# EAGLE design 8MBSIMM (EAGLE 6.2)
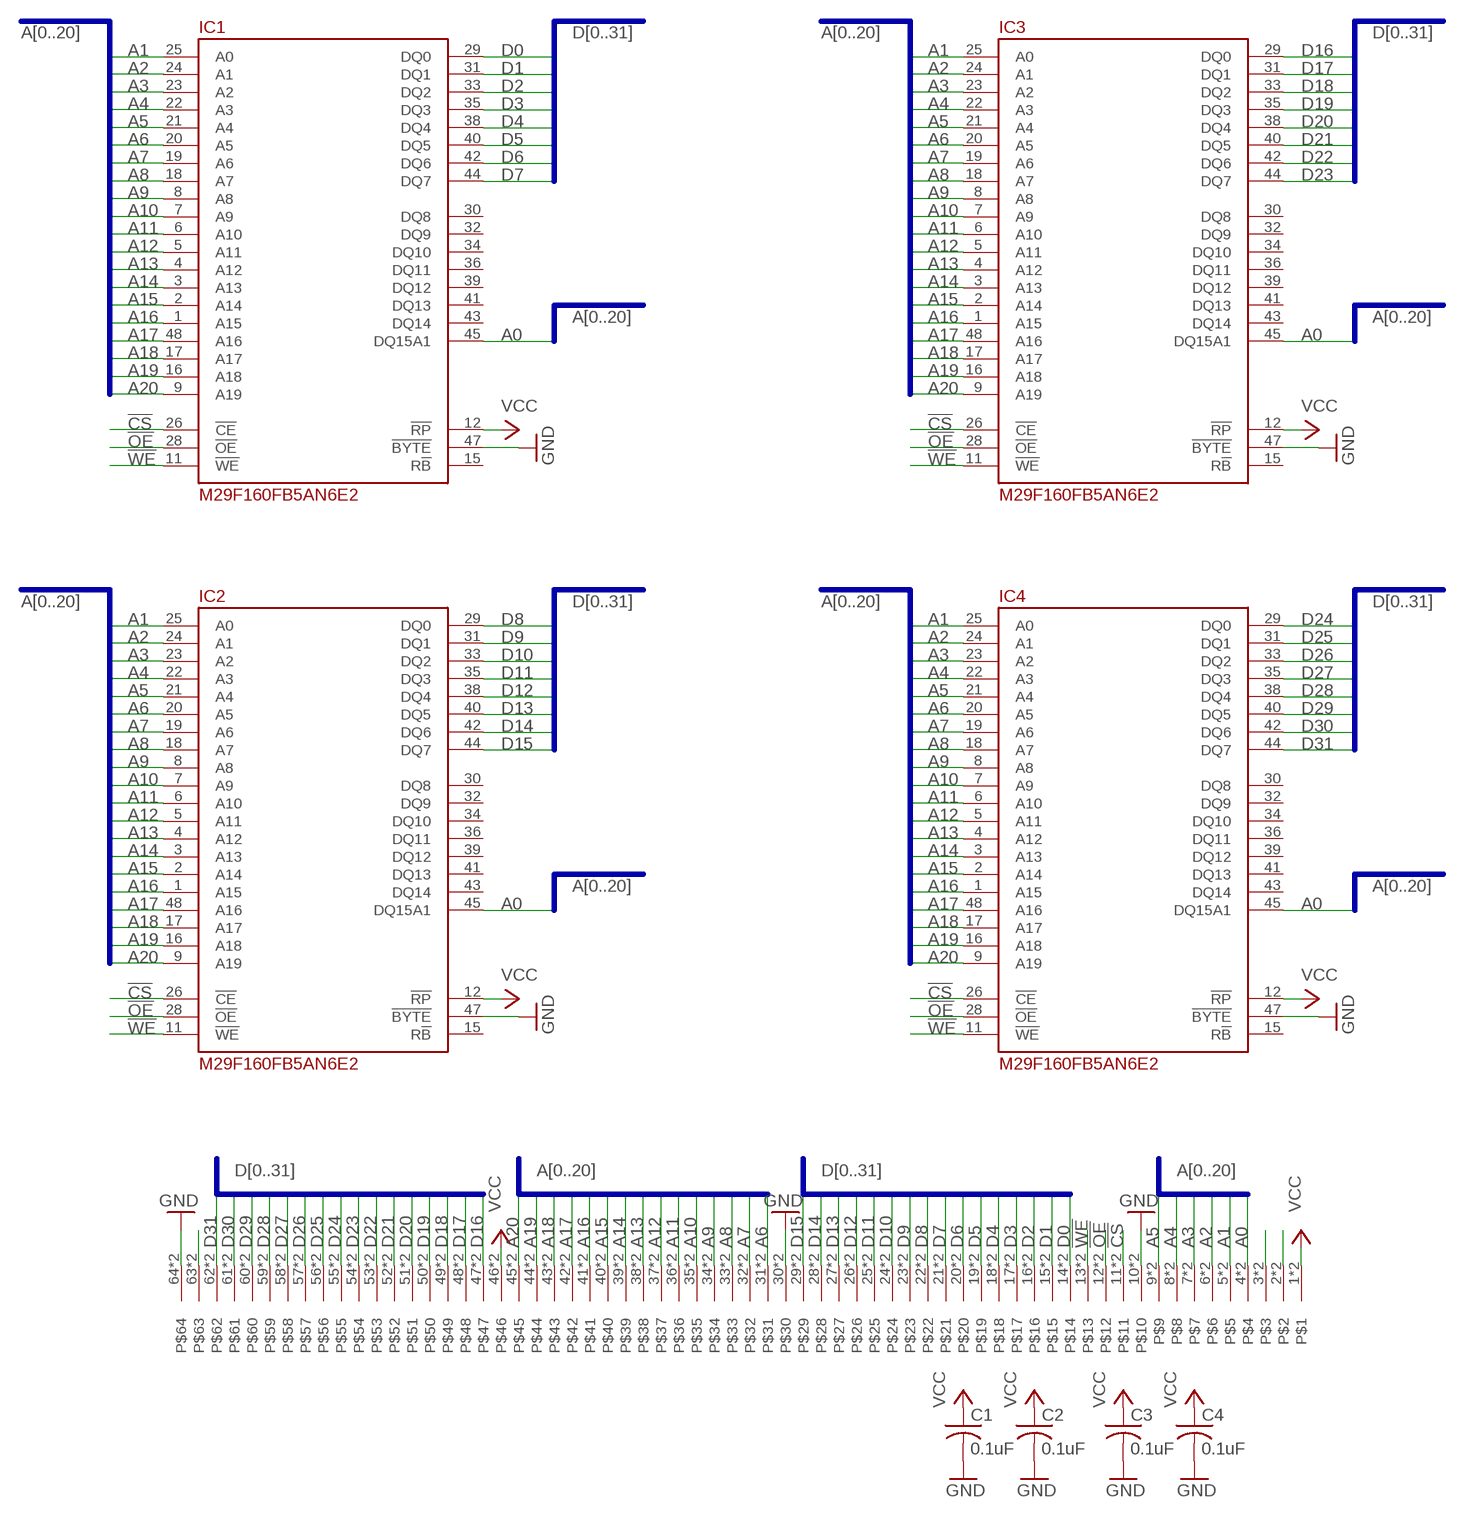
[diagram p0: schematic, sheet 1]

## Parts
C1  0.1uF  C-USC1206  [C1206]
C2  0.1uF  C-USC1206  [C1206]
C3  0.1uF  C-USC1206  [C1206]
C4  0.1uF  C-USC1206  [C1206]
CON1  MYSIMM  [SIMM64L]
IC1  M29F160FB5AN6E2  [TSOP48]
IC2  M29F160FB5AN6E2  [TSOP48]
IC3  M29F160FB5AN6E2  [TSOP48]
IC4  M29F160FB5AN6E2  [TSOP48]

## Nets
!CS: CON1.11 CON1.75 IC1.26(!CE) IC2.26(!CE) IC3.26(!CE) IC4.26(!CE)
!OE: CON1.12 CON1.76 IC1.28(!OE) IC2.28(!OE) IC3.28(!OE) IC4.28(!OE)
!WE: CON1.13 CON1.77 IC1.11(!WE) IC2.11(!WE) IC3.11(!WE) IC4.11(!WE)
A0: CON1.4 CON1.68 IC1.45(DQ15A1) IC2.45(DQ15A1) IC3.45(DQ15A1) IC4.45(DQ15A1)
A1: CON1.5 CON1.69 IC1.25(A0) IC2.25(A0) IC3.25(A0) IC4.25(A0)
A2: CON1.6 CON1.70 IC1.24(A1) IC2.24(A1) IC3.24(A1) IC4.24(A1)
A3: CON1.7 CON1.71 IC1.23(A2) IC2.23(A2) IC3.23(A2) IC4.23(A2)
A4: CON1.8 CON1.72 IC1.22(A3) IC2.22(A3) IC3.22(A3) IC4.22(A3)
A5: CON1.9 CON1.73 IC1.21(A4) IC2.21(A4) IC3.21(A4) IC4.21(A4)
A6: CON1.31 CON1.95 IC1.20(A5) IC2.20(A5) IC3.20(A5) IC4.20(A5)
A7: CON1.32 CON1.96 IC1.19(A6) IC2.19(A6) IC3.19(A6) IC4.19(A6)
A8: CON1.33 CON1.97 IC1.18(A7) IC2.18(A7) IC3.18(A7) IC4.18(A7)
A9: CON1.34 CON1.98 IC1.8(A8) IC2.8(A8) IC3.8(A8) IC4.8(A8)
A10: CON1.35 CON1.99 IC1.7(A9) IC2.7(A9) IC3.7(A9) IC4.7(A9)
A11: CON1.36 CON1.100 IC1.6(A10) IC2.6(A10) IC3.6(A10) IC4.6(A10)
A12: CON1.37 CON1.101 IC1.5(A11) IC2.5(A11) IC3.5(A11) IC4.5(A11)
A13: CON1.38 CON1.102 IC1.4(A12) IC2.4(A12) IC3.4(A12) IC4.4(A12)
A14: CON1.39 CON1.103 IC1.3(A13) IC2.3(A13) IC3.3(A13) IC4.3(A13)
A15: CON1.40 CON1.104 IC1.2(A14) IC2.2(A14) IC3.2(A14) IC4.2(A14)
A16: CON1.41 CON1.105 IC1.1(A15) IC2.1(A15) IC3.1(A15) IC4.1(A15)
A17: CON1.42 CON1.106 IC1.48(A16) IC2.48(A16) IC3.48(A16) IC4.48(A16)
A18: CON1.43 CON1.107 IC1.17(A17) IC2.17(A17) IC3.17(A17) IC4.17(A17)
A19: CON1.44 CON1.108 IC1.16(A18) IC2.16(A18) IC3.16(A18) IC4.16(A18)
A20: CON1.45 CON1.109 IC1.9(A19) IC2.9(A19) IC3.9(A19) IC4.9(A19)
D0: CON1.14 CON1.78 IC1.29(DQ0)
D1: CON1.15 CON1.79 IC1.31(DQ1)
D2: CON1.16 CON1.80 IC1.33(DQ2)
D3: CON1.17 CON1.81 IC1.35(DQ3)
D4: CON1.18 CON1.82 IC1.38(DQ4)
D5: CON1.19 CON1.83 IC1.40(DQ5)
D6: CON1.20 CON1.84 IC1.42(DQ6)
D7: CON1.21 CON1.85 IC1.44(DQ7)
D8: CON1.22 CON1.86 IC2.29(DQ0)
D9: CON1.23 CON1.87 IC2.31(DQ1)
D10: CON1.24 CON1.88 IC2.33(DQ2)
D11: CON1.25 CON1.89 IC2.35(DQ3)
D12: CON1.26 CON1.90 IC2.38(DQ4)
D13: CON1.27 CON1.91 IC2.40(DQ5)
D14: CON1.28 CON1.92 IC2.42(DQ6)
D15: CON1.29 CON1.93 IC2.44(DQ7)
D16: CON1.47 CON1.111 IC3.29(DQ0)
D17: CON1.48 CON1.112 IC3.31(DQ1)
D18: CON1.49 CON1.113 IC3.33(DQ2)
D19: CON1.50 CON1.114 IC3.35(DQ3)
D20: CON1.51 CON1.115 IC3.38(DQ4)
D21: CON1.52 CON1.116 IC3.40(DQ5)
D22: CON1.53 CON1.117 IC3.42(DQ6)
D23: CON1.54 CON1.118 IC3.44(DQ7)
D24: CON1.55 CON1.119 IC4.29(DQ0)
D25: CON1.56 CON1.120 IC4.31(DQ1)
D26: CON1.57 CON1.121 IC4.33(DQ2)
D27: CON1.58 CON1.122 IC4.35(DQ3)
D28: CON1.59 CON1.123 IC4.38(DQ4)
D29: CON1.60 CON1.124 IC4.40(DQ5)
D30: CON1.61 CON1.125 IC4.42(DQ6)
D31: CON1.62 CON1.126 IC4.44(DQ7)
GND [thicker]: C1.2 C2.2 C3.2 C4.2 CON1.10 CON1.30 CON1.64 CON1.74 CON1.94 CON1.128 IC1.47(!BYTE) IC2.47(!BYTE) IC3.47(!BYTE) IC4.47(!BYTE)
UNUSED1: CON1.2 CON1.66
UNUSED2: CON1.3 CON1.67
UNUSED3: CON1.63 CON1.127
VCC [thicker]: C1.1 C2.1 C3.1 C4.1 CON1.1 CON1.46 CON1.65 CON1.110 IC1.12(!RP) IC2.12(!RP) IC3.12(!RP) IC4.12(!RP)
Unconnected: IC1.15(R!B) IC1.30(DQ8) IC1.32(DQ9) IC1.34(DQ10) IC1.36(DQ11) IC1.39(DQ12) IC1.41(DQ13) IC1.43(DQ14) IC2.15(R!B) IC2.30(DQ8) IC2.32(DQ9) IC2.34(DQ10) IC2.36(DQ11) IC2.39(DQ12) IC2.41(DQ13) IC2.43(DQ14) IC3.15(R!B) IC3.30(DQ8) IC3.32(DQ9) IC3.34(DQ10) IC3.36(DQ11) IC3.39(DQ12) IC3.41(DQ13) IC3.43(DQ14) IC4.15(R!B) IC4.30(DQ8) IC4.32(DQ9) IC4.34(DQ10) IC4.36(DQ11) IC4.39(DQ12) IC4.41(DQ13) IC4.43(DQ14)

## Buses
A[0..20]
D[0..31]

## Power pins joined to a net without a drawn wire
GND: IC1.27(GND) IC1.46(GND) IC2.27(GND) IC2.46(GND) IC3.27(GND) IC3.46(GND) IC4.27(GND) IC4.46(GND)
VCC: IC1.37(VCC) IC2.37(VCC) IC3.37(VCC) IC4.37(VCC)

## Library data of the parts
C1-C4 = resistor:C-US: CAPACITOR, American symbol
CON1 = Doug:MYSIMM: 64-Pin SIMM
IC1-IC4 = Doug:M29F160FB5AN6E2

## Net classes
0 default: width 0.178 mm, drill 0.305 mm, clearance 0.178 mm
1 thicker: width 0.305 mm, drill 0.305 mm, clearance 0.178 mm

## Board
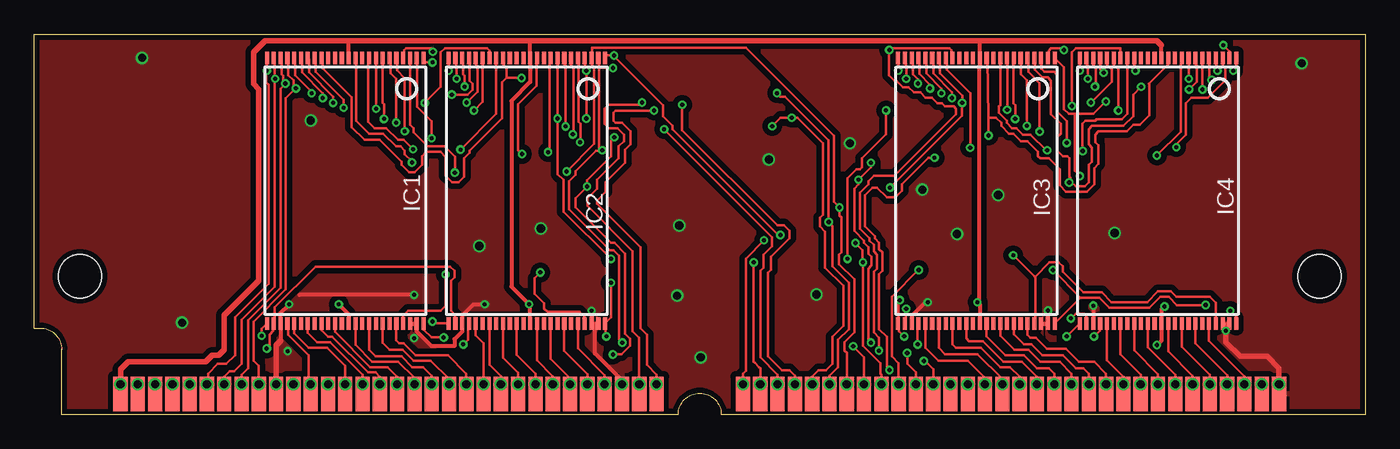
[diagram p1: board, top side]
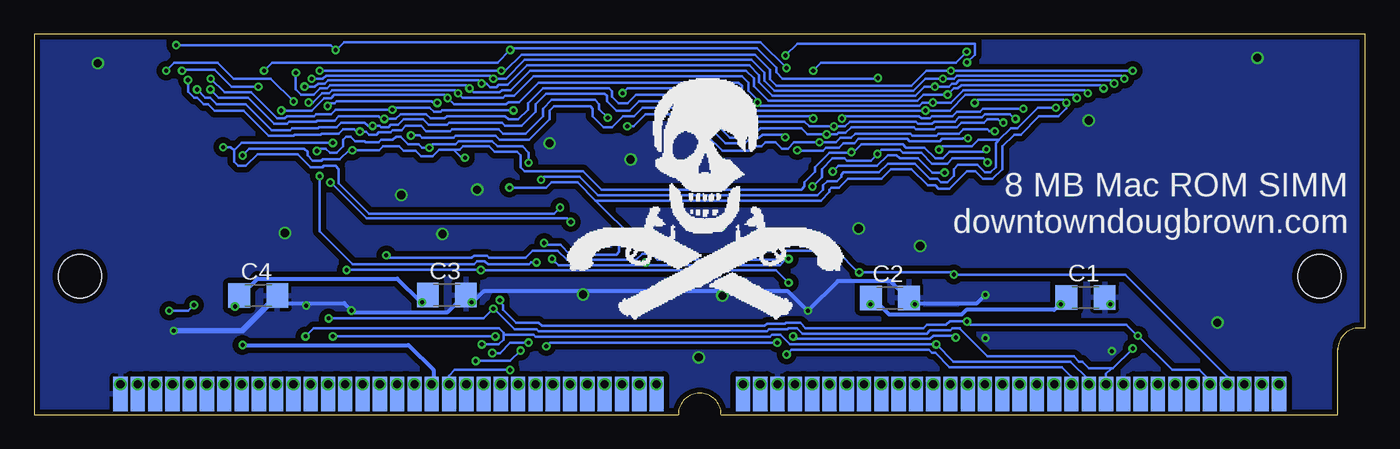
[diagram p2: board, bottom side, seen from below]

Size 97.79 x 27.94 mm. Coordinates in mm from the lower left corner, seen from the top.
Copper layers (1*2*15*16): Top 0.035mm / dielectric 0.2mm / layer 2 0.0175mm / dielectric 1.1mm / layer 15 0.0175mm / dielectric 0.2mm / Bottom 0.035mm
Design rules "SeeedStudio_DRU_no_angle_20130527": minimum track width 6mil, minimum drill 12mil, track to track 6mil, track to pad 6mil, pad to pad 6mil, via to via 6mil, smd to smd 0mil, copper to edge 10mil, drill to drill 10mil, minimum pad ring 6mil, minimum via ring 6mil, stop-mask expansion 2mil, vias tented up to drill 25mil, thermal gap 10mil

### Footprints (pad centres in the part's own frame; a part is rotated, then mirrored left to right if it is on the bottom)
C1206 = smd 1.6 x 1.8: 1 -1.4,0; 2 1.4,0
SIMM64L = smd 1.041 x 2.54: 1 -42.545,-8.636; 2 -41.275,-8.636; 3 -40.005,-8.636; 4 -38.735,-8.636; 5 -37.465,-8.636; 6 -36.195,-8.636; 7 -34.925,-8.636; 8 -33.655,-8.636; 9 -32.385,-8.636; 10 -31.115,-8.636; 11 -29.845,-8.636; 12 -28.575,-8.636; 13 -27.305,-8.636; 14 -26.035,-8.636; 15 -24.765,-8.636; 16 -23.495,-8.636; 17 -22.225,-8.636; 18 -20.955,-8.636; 19 -19.685,-8.636; 20 -18.415,-8.636; 21 -17.145,-8.636; 22 -15.875,-8.636; 23 -14.605,-8.636; 24 -13.335,-8.636; 25 -12.065,-8.636; 26 -10.795,-8.636; 27 -9.525,-8.636; 28 -8.255,-8.636; 29 -6.985,-8.636; 30 -5.715,-8.636; 31 -4.445,-8.636; 32 -3.175,-8.636; 33 3.175,-8.636; 34 4.445,-8.636; 35 5.715,-8.636; 36 6.985,-8.636; 37 8.255,-8.636; 38 9.525,-8.636; 39 10.795,-8.636; 40 12.065,-8.636; 41 13.335,-8.636; 42 14.605,-8.636; 43 15.875,-8.636; 44 17.145,-8.636; 45 18.415,-8.636; 46 19.685,-8.636; 47 20.955,-8.636; 48 22.225,-8.636; 49 23.495,-8.636; 50 24.765,-8.636; 51 26.035,-8.636; 52 27.305,-8.636; 53 28.575,-8.636; 54 29.845,-8.636; 55 31.115,-8.636; 56 32.385,-8.636; 57 33.655,-8.636; 58 34.925,-8.636; 59 36.195,-8.636; 60 37.465,-8.636; 61 38.735,-8.636; 62 40.005,-8.636; 63 41.275,-8.636; 64 42.545,-8.636 | smd 1.041 x 2.54 bottom: 65 -42.545,-8.636; 66 -41.275,-8.636; 67 -40.005,-8.636; 68 -38.735,-8.636; 69 -37.465,-8.636; 70 -36.195,-8.636; 71 -34.925,-8.636; 72 -33.655,-8.636; 73 -32.385,-8.636; 74 -31.115,-8.636; 75 -29.845,-8.636; 76 -28.575,-8.636; 77 -27.305,-8.636; 78 -26.035,-8.636; 79 -24.765,-8.636; 80 -23.495,-8.636; 81 -22.225,-8.636; 82 -20.955,-8.636; 83 -19.685,-8.636; 84 -18.415,-8.636; 85 -17.145,-8.636; 86 -15.875,-8.636; 87 -14.605,-8.636; 88 -13.335,-8.636; 89 -12.065,-8.636; 90 -10.795,-8.636; 91 -9.525,-8.636; 92 -8.255,-8.636; 93 -6.985,-8.636; 94 -5.715,-8.636; 95 -4.445,-8.636; 96 -3.175,-8.636; 97 3.175,-8.636; 98 4.445,-8.636; 99 5.715,-8.636; 100 6.985,-8.636; 101 8.255,-8.636; 102 9.525,-8.636; 103 10.795,-8.636; 104 12.065,-8.636; 105 13.335,-8.636; 106 14.605,-8.636; 107 15.875,-8.636; 108 17.145,-8.636; 109 18.415,-8.636; 110 19.685,-8.636; 111 20.955,-8.636; 112 22.225,-8.636; 113 23.495,-8.636; 114 24.765,-8.636; 115 26.035,-8.636; 116 27.305,-8.636; 117 28.575,-8.636; 118 29.845,-8.636; 119 31.115,-8.636; 120 32.385,-8.636; 121 33.655,-8.636; 122 34.925,-8.636; 123 36.195,-8.636; 124 37.465,-8.636; 125 38.735,-8.636; 126 40.005,-8.636; 127 41.275,-8.636; 128 42.545,-8.636 | hole 3.175: 45.517,0; -45.517,0
TSOP48 = smd 0.9 x 0.3: 1 -9.75,5.75; 2 -9.75,5.25; 3 -9.75,4.75; 4 -9.75,4.25; 5 -9.75,3.75; 6 -9.75,3.25; 7 -9.75,2.75; 8 -9.75,2.25; 9 -9.75,1.75; 10 -9.75,1.25; 11 -9.75,0.75; 12 -9.75,0.25; 13 -9.75,-0.25; 14 -9.75,-0.75; 15 -9.75,-1.25; 16 -9.75,-1.75; 17 -9.75,-2.25; 18 -9.75,-2.75; 19 -9.75,-3.25; 20 -9.75,-3.75; 21 -9.75,-4.25; 22 -9.75,-4.75; 23 -9.75,-5.25; 24 -9.75,-5.75; 25 9.75,-5.75; 26 9.75,-5.25; 27 9.75,-4.75; 28 9.75,-4.25; 29 9.75,-3.75; 30 9.75,-3.25; 31 9.75,-2.75; 32 9.75,-2.25; 33 9.75,-1.75; 34 9.75,-1.25; 35 9.75,-0.75; 36 9.75,-0.25; 37 9.75,0.25; 38 9.75,0.75; 39 9.75,1.25; 40 9.75,1.75; 41 9.75,2.25; 42 9.75,2.75; 43 9.75,3.25; 44 9.75,3.75; 45 9.75,4.25; 46 9.75,4.75; 47 9.75,5.25; 48 9.75,5.75

### Placement (x,y rotation side)
C1  20.56,8.61 0 bottom
C2  34.93,8.57 0 bottom
C3  67.47,8.77 0 bottom
C4  81.32,8.73 0 bottom
CON1  48.9,10.16 0 top
IC1  22.86,16.43 270 top
IC2  36.2,16.43 270 top
IC3  69.22,16.43 270 top
IC4  82.55,16.43 270 top
U$1  [JOLLYROGER]  58.58,7.06 0 bottom

### Tracks (layer width: path | path; a pad name or v marks a point on that pad's centre or on a via)
!CS  (via drill 0.3, 0.6)
  Top 0.178: v64.06,7.77 64.03,7.75 64.03,6.76 63.98,6.71 IC3.26 | v76.15,7.06 76.5,7.42 77.12,7.42 77.3,7.23 IC4.26 | IC2.26 30.94,6.71 30.94,7.32 30.64,7.62 30.64,9.84 30.88,10.08 30.88,10.56 30.56,10.87 20.68,10.87 17.68,7.87 17.68,6.76 17.63,6.71 IC1.26 17.58,6.6 17.58,6.15 17.3,5.87 17.3,5.05 v17.09,4.85
  Top 0.406: CON1.75 v19.05,2.22
  Bottom 0.178: v76.15,7.06 64.77,7.06 v64.06,7.77 63.98,7.75 62.51,6.27 60.88,6.27 60.72,6.11 43.97,6.11 43.82,6.27 42.47,6.27 42.39,6.35 41.75,6.35 41.35,5.95 32.23,5.95 31.99,6.19 30.48,6.19 30.35,6.33 29.8,6.33 29.8,6.31 27.78,4.29 21.43,4.29 21.03,3.89 20.8,3.89 20.31,3.4 18.64,3.4 | 18.64,3.4 19.05,3 v19.05,2.22 | 18.64,3.4 18.54,3.4 v17.09,4.85
  Bottom 0.305: CON1.75 v19.05,2.22
!OE  (via drill 0.3, 0.6)
  Top 0.178: v64.9,5.16 64.9,6.63 64.95,6.68 IC3.28 | v77.85,5.74 78.28,6.17 78.28,6.68 IC4.28 | IC1.28 18.67,6.63 18.67,5.86 20.16,4.37 20.16,2.38 v20.32,2.22 | v31.52,5.16 31.88,5.51 31.88,6.63 31.93,6.68 IC2.28
  Top 0.406: CON1.76 v20.32,2.22
  Bottom 0.178: v64.9,5.16 63.68,5.16 63.32,5.51 63.32,5.87 | v77.85,5.74 77.27,6.33 63.63,6.33 63.32,6.01 63.32,5.87 | 63.32,5.87 61.11,5.87 60.96,5.71 43.74,5.71 43.58,5.87 42.98,5.87 42.27,5.16 v31.52,5.16 30.26,3.89 21.67,3.89 20.32,2.54 v20.32,2.22
  Bottom 0.305: CON1.76 v20.32,2.22
!WE  (via drill 0.3, 0.6)
  Top 0.178: v70.11,20.49 70.09,21.81 | 70.09,21.81 70.03,26.11 69.98,26.16 IC3.11 | IC4.11 83.29,26.16 83.29,25.68 81.89,24.28 81.91,24.26 81.91,21.99 81.2,21.27 80.72,21.27 80.25,20.8 78.18,20.8 77.95,20.56 77.95,20 78.18,19.76 78.18,18.41 77.87,18.1 77.87,16.91 77.31,16.35 75.8,16.35 75.33,16.83 75.33,18.02 74.53,18.81 73.9,18.81 73.74,18.97 73.74,19.29 72.95,20.08 72.47,20.08 71.91,20.64 71.6,20.64 71.04,21.19 71.04,21.43 70.66,21.81 70.09,21.81 | IC1.11 23.62,26.16 23.67,26.11 23.67,21.57 24.6,20.64 25.64,20.64 26.59,19.68 26.91,19.68 27.23,19.37 27.23,19.13 27.76,18.6 v27.76,18.51 | 36.93,26.16 IC2.11 36.91,26.14 36.91,24.13 35.56,22.78 35.56,19.43 v35.85,19.14 | v42.62,20.36 42.39,20.13 42.39,18.97 40.62,17.2 v40.62,16.74 39.77,15.89 39.77,15.24 42.39,12.62 42.62,12.62 43.42,11.83 43.42,5.95 43.79,5.58 43.79,5.05 43.15,4.42 v42.52,4.42
  Top 0.406: CON1.77 v21.59,2.22
  Bottom 0.178: v27.76,18.51 28.06,18.81 30.32,18.81 30.72,18.41 31.83,18.41 32.62,19.21 33.97,19.21 34.21,19.45 35.54,19.45 v35.85,19.14 36.33,18.65 38.1,18.65 38.26,18.81 39.13,18.81 39.93,18.02 39.93,17.43 v40.62,16.74 | v42.62,20.36 42.82,20.56 44.29,20.56 44.53,20.32 45.16,20.32 45.56,19.92 46.99,19.92 47.94,20.88 47.94,22.15 48.34,22.54 53.1,22.54 53.74,21.91 54.53,21.91 55.32,21.11 55.96,21.11 56.75,21.91 56.75,22.46 56.91,22.62 59.61,22.62 59.93,22.3 59.93,21.67 61.44,20.16 63.58,20.16 63.9,20.48 66.83,20.48 66.99,20.32 69.29,20.32 69.47,20.49 v70.11,20.49 | v42.52,4.42 42.17,4.76 32.07,4.76 31.83,4.52 31.59,4.52 30.56,3.49 22.29,3.49 21.59,2.79 v21.59,2.22
  Bottom 0.305: CON1.77 v21.59,2.22
A0  (via drill 0.3, 0.6)
  Top 0.178: 73.53,10.13 73.53,6.76 73.48,6.71 IC3.45 | IC4.45 86.79,6.71 86.79,8.22 86.36,8.65 83.9,8.65 83.5,9.05 82.55,9.05 81.76,8.26 79.14,8.26 78.42,8.97 77.07,8.97 75.56,10.48 75.56,10.87 75.25,11.19 74.59,11.19 73.53,10.13 | IC2.45 40.44,6.71 40.44,7.19 40.08,7.54 37.7,7.54 37.47,7.78 37.47,8.18 36.75,8.89 36.75,10 v37.19,10.44 | v71.92,11.7 73.46,10.16 73.53,10.13 | IC1.45 27.11,7.27 27.46,7.62 29.85,7.62 30.23,8 v30.23,10.29
  Top 0.406: CON1.68 v10.16,2.22
  Bottom 0.178: v10.16,2.22 10.16,2.79 17.63,10.26 30.15,10.26 v30.23,10.29 30.38,10.44 v37.19,10.44 37.26,10.46 38.81,12.01 42.68,12.01 43.34,11.35 51.99,11.35 52.47,11.83 53.1,11.83 53.58,11.35 58.66,11.35 59.32,12.01 61.17,12.01 61.67,11.51 64.37,11.51 64.53,11.67 65.48,11.67 65.64,11.51 71.73,11.51 v71.92,11.7
  Bottom 0.305: CON1.68 v10.16,2.22
A1  (via drill 0.3, 0.6)
  Top 0.178: v63.91,5.74 63.52,6.12 63.52,6.63 IC3.25 63.48,6.76 63.48,8.31 v63.58,8.41 | v75.84,5.74 76.78,6.68 IC4.25 | v16.71,5.79 16.71,6.3 17.09,6.68 IC1.25 | v29.26,6.83 29.26,6.71 30.43,6.71 IC2.25
  Top 0.406: CON1.69 v11.43,2.22
  Bottom 0.178: v75.84,5.74 v63.91,5.74 | 11.51,2.59 12.19,3.28 14.2,3.28 v16.71,5.79 16.79,5.82 17.58,6.6 29.03,6.6 v29.26,6.83 29.34,6.86 30.53,6.86 30.8,6.59 32.23,6.59 32.46,6.35 41.12,6.35 41.51,6.75 42.55,6.75 42.62,6.67 43.97,6.67 44.13,6.51 60.48,6.51 60.72,6.75 62.39,6.75 63.34,7.7 63.34,8.02 63.58,8.25 v63.58,8.41
  Bottom 0.305: CON1.69 v11.43,2.22 11.43,2.59 11.51,2.59
A2  (via drill 0.3, 0.6)
  Top 0.178: v63.48,25.25 63.48,26.16 IC3.24 | v76.81,25.25 76.81,26.16 IC4.24 | CON1.70 12.78,2.41 12.78,3.01 13.49,3.73 14.13,3.73 14.76,4.37 14.76,7.14 17.22,9.6 17.22,24.21 17.07,24.37 17.07,25.22 v17.09,25.25 17.09,26.16 IC1.24 | v30.46,25.25 30.46,26.16 IC2.24
  Top 0.406: CON1.70 v12.7,2.22
  Bottom 0.178: v76.81,25.25 v63.48,25.25 63.18,25.25 61.99,26.43 44.85,26.43 43.74,25.32 43.74,24.61 43.26,24.13 33.35,24.13 32.23,25.25 v30.46,25.25 v17.09,25.25
  Bottom 0.305: CON1.70 v12.7,2.22
A3  (via drill 0.3, 0.6)
  Top 0.178: v64.06,24.66 64.06,25.48 64.03,25.5 64.03,26.11 63.98,26.16 IC3.23 | v77.39,24.66 77.39,25.6 77.32,25.68 77.32,26.16 IC4.23 | 17.68,24.66 17.68,9.4 15.24,6.96 15.24,3.73 14.68,3.17 14.37,3.17 13.97,2.78 v13.97,2.22 | 17.68,24.66 17.68,26.11 17.63,26.16 IC1.23 | v31.04,24.66 31.04,25.48 31.01,25.5 31.01,26.11 30.96,26.16 IC2.23 | v17.7,24.66 17.68,24.66
  Top 0.406: CON1.71 v13.97,2.22
  Bottom 0.178: v77.39,24.66 76.58,24.66 76.35,24.89 64.29,24.89 v64.06,24.66 63.12,24.66 61.75,26.04 45.09,26.04 44.13,25.08 44.13,24.5 43.41,23.77 33.2,23.77 32.31,24.66 v31.04,24.66 30.23,24.66 30,24.89 17.93,24.89 v17.7,24.66
  Bottom 0.305: CON1.71 v13.97,2.22
A4  (via drill 0.3, 0.6)
  Top 0.178: v64.92,24.31 64.92,24.61 64.54,24.99 64.54,26.09 64.47,26.16 IC3.22 | v77.93,24.08 77.98,24.13 77.98,25.5 77.8,25.68 77.8,26.16 IC4.22 | IC1.22 18.11,26.16 18.19,26.09 18.19,24.99 18.29,24.89 18.29,24.31 v18.47,24.31 18.1,23.94 18.1,9.31 15.72,6.93 15.72,3.41 15.24,2.94 v15.24,2.22 | v31.62,24.08 31.62,24.89 31.52,24.99 31.52,26.09 31.45,26.16 IC2.22
  Top 0.406: CON1.72 v15.24,2.22
  Bottom 0.178: v77.93,24.08 77.16,24.08 76.94,24.31 76.43,24.31 76.2,24.54 65.15,24.54 v64.92,24.31 64.55,24.31 64.29,24.05 63.82,24.05 63.66,24.21 63.02,24.21 61.59,25.64 45.24,25.64 44.53,24.92 44.53,24.39 43.56,23.42 33.05,23.42 32.41,24.05 31.7,24.05 v31.62,24.08 30.61,24.08 30.38,24.31 30.07,24.31 29.85,24.54 18.69,24.54 v18.47,24.31
  Bottom 0.305: CON1.72 v15.24,2.22
A5  (via drill 0.3, 0.6)
  Top 0.178: v65.81,23.95 65.81,24.23 65.02,25.02 65.02,26.11 64.97,26.16 IC3.21 | v78.56,25.09 78.33,25.32 78.33,26.14 78.31,26.16 IC4.21 | IC1.21 18.62,26.16 18.67,26.11 18.67,24.92 19.05,24.54 19.05,24.13 v19.23,23.95 18.49,23.22 18.49,9.2 16.13,6.83 16.13,3.95 16.51,3.57 v16.51,2.22 | v30.68,23.5 31.85,23.5 32.21,23.85 32.21,24.31 32,24.51 32,26.11 31.95,26.16 IC2.21
  Top 0.406: CON1.73 v16.51,2.22
  Bottom 0.178: v78.56,25.09 78.56,23.9 78.16,23.5 77.24,23.5 76.78,23.95 76.28,23.95 76.05,24.18 66.04,24.18 v65.81,23.95 65.51,23.65 63.58,23.65 63.42,23.81 62.79,23.81 61.36,25.24 45.48,25.24 44.93,24.69 44.93,24.12 43.84,23.04 32.92,23.04 32.46,23.5 v30.68,23.5 30.23,23.95 29.92,23.95 29.69,24.18 19.46,24.18 v19.23,23.95
  Bottom 0.305: CON1.73 v16.51,2.22
A6  (via drill 0.3, 0.6)
  Top 0.178: v66.65,23.6 66.65,23.93 65.53,25.04 65.53,26.11 65.48,26.16 IC3.20 | v77.62,22.91 79.15,24.43 79.15,25.32 78.82,25.65 78.82,26.16 IC4.20 | v20.4,23.6 20.4,23.7 19.18,24.92 19.18,26.11 19.13,26.16 IC1.20 | v31.77,22.91 32.56,23.7 32.56,25.58 32.46,25.68 32.46,26.16 IC2.20 | v44.45,2.22 44.45,5.64 43.97,6.11 43.97,11.99 40.64,15.32 40.64,15.88 41.35,16.59 41.35,17.22 42.94,18.81 42.94,19.68 43.34,20.08 43.34,20.56 42.86,21.03 42.23,21.03 41.91,21.35 41.91,22.44 42.23,22.76 44.5,22.76 v44.65,22.91
  Top 0.406: CON1.95 v44.45,2.22
  Bottom 0.178: v77.62,22.91 77.32,22.91 76.63,23.6 76.12,23.6 75.9,23.82 66.88,23.82 v66.65,23.6 66.31,23.26 63.34,23.26 63.18,23.42 62.55,23.42 61.12,24.84 45.8,24.84 45.32,24.37 45.32,23.77 44.65,23.1 v44.65,22.91 44.43,22.68 32.77,22.68 32.54,22.91 v31.77,22.91 30.46,22.91 29.54,23.82 20.63,23.82 v20.4,23.6
  Bottom 0.305: CON1.95 v44.45,2.22
A7  (via drill 0.3, 0.6)
  Top 0.178: v67.41,23.24 67.41,23.67 66.04,25.04 66.04,26.11 65.99,26.16 IC3.19 | v79.63,22.33 79.63,25.35 79.32,25.65 79.32,26.16 IC4.19 | v21.21,23.24 21.21,23.6 19.69,25.12 19.69,26.11 19.63,26.16 IC1.19 | v32.31,22.33 32.94,22.96 32.94,26.16 IC2.19 | v45.72,2.22 45.72,2.94 45.01,3.65 45.01,5.87 44.53,6.35 44.53,12.3 41.35,15.48 41.35,15.72 41.99,16.35 41.99,17.07 43.42,18.49 43.42,19.45 43.82,19.84 43.82,20.8 43.18,21.43 42.7,21.43 42.55,21.59 42.55,22.17 42.7,22.33 v45.54,22.33
  Top 0.406: CON1.96 v45.72,2.22
  Bottom 0.178: v79.63,22.33 77.39,22.33 76.48,23.24 75.97,23.24 75.74,23.47 67.64,23.47 v67.41,23.24 66.95,22.78 63.1,22.78 62.94,22.94 62.15,22.94 60.72,24.37 46.04,24.37 45.8,24.13 45.8,22.58 v45.54,22.33 v32.31,22.33 30.53,22.33 29.39,23.47 21.44,23.47 v21.21,23.24
  Bottom 0.305: CON1.96 v45.72,2.22
A8  (via drill 0.3, 0.6)
  Top 0.178: v21.97,22.89 21.97,23.34 20.19,25.12 20.19,26.09 20.12,26.16 IC1.18 | v28.7,22.89 29.87,24.05 29.87,26.59 30.19,26.91 33.26,26.91 33.45,26.72 IC2.18 | v76.22,22.66 76.22,26.59 76.53,26.9 79.78,26.9 79.78,26.19 IC4.18 | IC3.18 66.47,26.16 66.55,26.09 66.55,25.04 68.17,23.42 v68.17,22.89 68.15,22.81 68.15,21.94 v62.88,16.66 | v53.62,12.8 52.27,11.46 52.27,3.22 52.07,3.02 v52.07,2.22
  Top 0.406: CON1.97 v52.07,2.22
  Bottom 0.178: v21.97,22.89 22.2,23.11 28.47,23.11 v28.7,22.89 | 56.53,15.72 57.88,17.07 59.77,17.07 60.17,16.66 v62.88,16.66 | 56.53,15.72 v53.62,12.8 | 22,22.81 v21.97,22.89 | v21.97,22.89 21.97,22.48 22.54,21.91 23.97,21.91 25.32,20.56 25.8,20.56 26.67,19.68 26.67,18.02 27.38,17.3 28.1,17.3 28.65,17.86 29.29,17.86 30.56,16.59 31.35,16.59 31.59,16.83 32.15,16.83 33.34,18.02 34.85,18.02 35.56,17.3 38.02,17.3 38.66,16.67 39.21,16.67 39.37,16.51 39.37,16.35 40.01,15.72 56.53,15.72 | v68.17,22.89 68.45,22.89 68.58,23.02 75.56,23.02 75.72,22.86 76.02,22.86 v76.22,22.66
  Bottom 0.305: CON1.97 v52.07,2.22
A9  (via drill 0.3, 0.6)
  Top 0.178: v71.48,22.38 71.48,26.16 IC3.8 | v84.81,24.66 84.81,26.16 IC4.8 | v25.12,22.46 25.12,26.16 IC1.8 | IC2.8 38.46,26.16 v38.46,21.74 38.46,17.66 38.89,17.22 38.89,14.9 v42.37,11.43 | v59.74,11.43 59.74,17.36 60.4,18.02 60.64,18.02 60.8,18.18 60.8,18.81 62.58,20.59 v62.58,22.33 | v53.34,2.22 53.34,3.41 53.26,3.49 52.94,3.81 52.86,3.9 v52.86,11.18
  Top 0.406: CON1.98 v53.34,2.22
  Bottom 0.178: v25.12,22.46 28.11,22.46 28.34,22.23 30,22.23 30.32,21.91 31.83,21.91 31.99,21.75 32.62,21.75 32.78,21.91 38.29,21.91 v38.46,21.74 | 59.51,11.2 v59.74,11.43 59.27,10.95 53.08,10.95 v52.86,11.18 52.64,10.95 43.02,10.95 42.55,11.43 v42.37,11.43 | v62.58,22.33 67.84,22.33 67.94,22.23 68.42,22.23 68.74,22.54 71.31,22.54 v71.48,22.38 75.65,22.38 75.96,22.07 77.07,22.07 77.23,21.91 79.22,21.91 79.38,21.75 79.93,21.75 81.84,23.65 83.8,23.65 v84.81,24.66
  Bottom 0.305: CON1.98 v53.34,2.22
A10  (via drill 0.3, 0.6)
  Top 0.178: v84.84,23.88 85.4,24.43 85.4,25.6 85.32,25.68 85.32,26.16 IC4.7 | 71.98,26.16 IC3.7 71.91,26.13 71.91,22.86 72.06,22.71 v72.06,21.71 | 25.68,26.11 25.63,26.16 IC1.7 25.61,22.89 25.71,22.79 v25.71,21.71 | v39.04,21.16 39.04,25.6 38.96,25.68 38.96,26.16 IC2.7 | v46.28,20.95 54.2,13.03 54.2,12.37 53.58,11.75 53.58,10.79 53.34,10.56 53.34,4.21 54.61,2.94 v54.61,2.22
  Top 0.406: CON1.99 v54.61,2.22
  Bottom 0.178: v25.71,21.71 25.76,21.71 26.11,22.07 27.94,22.07 28.18,21.83 29.85,21.83 30.16,21.51 31.67,21.51 31.83,21.35 32.86,21.35 33.02,21.51 37.88,21.51 38.23,21.16 v39.04,21.16 40.84,21.16 41.2,21.51 44.69,21.51 44.93,21.27 45.96,21.27 v46.28,20.95 46.28,21.2 46.83,21.75 46.83,23.26 47.07,23.5 53.58,23.5 54.21,22.86 54.85,22.86 55.32,23.34 55.32,23.73 55.56,23.97 60.4,23.97 61.52,22.86 61.52,22.38 62.23,21.67 62.94,21.67 63.18,21.91 67.47,21.91 67.63,21.75 68.66,21.75 68.98,22.07 70.88,22.07 71.23,21.71 v72.06,21.71 72.28,21.71 72.47,21.91 75.41,21.91 75.72,21.59 76.99,21.59 77.07,21.51 79.06,21.51 79.22,21.35 80.17,21.35 82.07,23.26 84.22,23.26 v84.84,23.88
  Bottom 0.305: CON1.99 v54.61,2.22
A11  (via drill 0.3, 0.6)
  Top 0.178: 85.8,26.16 IC4.6 85.82,26.16 v85.82,23.87 | v26.59,21.44 26.59,24.65 26.19,25.06 26.19,26.09 26.11,26.16 IC1.6 | v39.57,20.57 39.62,20.62 39.62,25.5 39.45,25.68 39.45,26.16 IC2.6 | v55.88,2.22 55.88,2.86 55.48,3.25 54.93,3.25 53.9,4.29 53.9,10.4 54.13,10.64 54.13,11.59 55.48,12.94 55.48,13.49 55.09,13.89 54.61,13.89 47.61,20.89 v47.61,22.75 | v72.92,21.2 72.92,24.55 72.47,25 IC3.6
  Top 0.406: CON1.100 v55.88,2.22
  Bottom 0.178: v26.59,21.44 26.76,21.44 26.99,21.67 27.78,21.67 28.02,21.43 29.69,21.43 30,21.11 31.51,21.11 31.67,20.95 33.02,20.95 33.18,21.11 37.76,21.11 38.2,20.68 38.71,20.68 38.81,20.57 v39.57,20.57 40.97,20.57 41.43,21.03 44.45,21.03 44.69,20.8 45.4,20.8 45.88,20.32 46.67,20.32 47.39,21.03 47.39,22.53 v47.61,22.75 47.61,22.76 47.86,23.02 53.34,23.02 54.05,22.3 55.01,22.3 55.72,23.02 55.72,23.42 55.88,23.57 60.17,23.57 60.96,22.78 60.96,22.23 61.99,21.19 63.18,21.19 63.42,21.43 67.31,21.43 67.47,21.27 68.82,21.27 69.22,21.67 70.64,21.67 71.04,21.27 71.6,21.27 71.75,21.11 72.31,21.11 72.4,21.2 v72.92,21.2 | v72.92,21.19 v72.92,21.2 | v72.92,21.2 73.27,21.2 73.5,21.43 75.25,21.43 75.56,21.11 76.84,21.11 76.91,21.03 78.82,21.03 78.98,20.88 80.33,20.88 82.23,22.78 84.38,22.78 84.85,23.26 85.2,23.26 v85.82,23.87
  Bottom 0.305: CON1.100 v55.88,2.22
A12  (via drill 0.3, 0.6)
  Top 0.178: 73.03,26.11 72.97,26.16 IC3.5 73.03,26.12 73.03,25.16 73.86,24.33 v73.86,20.77 | v86.48,24.57 86.31,24.74 86.31,26.16 IC4.5 | v27.23,20.8 27.23,24.71 26.67,25.27 26.67,26.11 26.62,26.16 IC1.5 | v40.11,19.99 40.16,20.04 40.16,21.34 39.98,21.51 39.98,26.14 39.95,26.16 IC2.5 | CON1.101 v57.15,2.22 57.15,2.78 57.63,3.25 58.18,3.25 58.66,3.73 58.66,5.71 59.45,6.51 59.45,9.45 58.1,10.79 58.1,13.41 57.71,13.81 57.71,14.45 57.94,14.68 57.94,19.92 56.08,21.79 v55.65,21.79 54.83,21.79 v54.22,21.18
  Bottom 0.178: v27.23,20.8 27.62,20.8 27.78,20.95 29.53,20.95 29.85,20.64 31.35,20.64 31.51,20.48 33.26,20.48 33.42,20.64 37.47,20.64 37.78,20.32 38.56,20.32 38.89,19.99 v40.11,19.99 41.96,19.99 42.42,19.53 42.86,19.53 43.34,20 44.05,20 44.37,19.68 45.01,19.68 45.32,19.37 47.23,19.37 48.42,20.56 48.42,21.83 48.66,22.07 52.86,22.07 53.75,21.18 v54.22,21.18 | v55.65,21.79 56.28,22.42 56.28,22.78 56.59,23.1 59.77,23.1 60.4,22.46 60.4,21.91 61.67,20.64 63.34,20.64 63.66,20.95 67.07,20.95 67.23,20.8 68.98,20.8 69.37,21.19 70.49,21.19 70.8,20.88 71.44,20.88 71.6,20.72 72.47,20.72 72.63,20.56 73.18,20.56 73.4,20.77 v73.86,20.77 74.11,20.77 74.3,20.95 75.09,20.95 75.41,20.64 76.68,20.64 76.76,20.56 78.66,20.56 78.74,20.48 80.57,20.48 82.39,22.3 84.53,22.3 85.01,22.78 85.33,22.78 85.8,23.26 86.04,23.26 86.48,23.7 v86.48,24.57
  Bottom 0.305: CON1.101 v57.15,2.22
A13  (via drill 0.3, 0.6)
  Top 0.178: v29.29,26.64 29.29,26.9 27.33,26.9 27.18,26.75 27.18,26.24 27.13,26.19 IC1.4 | IC2.4 40.46,26.16 40.46,25.35 v40.56,25.25 v40.56,21.74 | 76.12,17.14 76.5,16.77 77.17,16.77 77.47,17.07 77.47,18.34 77.71,18.57 77.71,19.61 77.47,19.84 77.47,20.95 77.71,21.19 80.01,21.19 80.72,21.91 80.72,23.5 v81.3,24.07 v81.31,24.07 | v86.92,25.25 86.82,25.35 86.82,26.16 IC4.4 | v76.02,17.04 76.12,17.14 | v54.57,23.6 54.84,23.34 55.17,23.34 58.34,20.16 58.34,14.16 v58.37,14.13 58.66,13.85 58.66,10.87 59.85,9.68 59.85,6.27 59.05,5.48 59.05,3.49 58.42,2.86 v58.42,2.22 | 76.12,17.14 76.12,17.38 76.04,17.46 76.04,18.81 75.88,18.97 75.56,18.97 75.17,19.37 75.17,20.4 75.41,20.64 75.41,21.35 74.69,22.07 74.69,24.53 74.45,24.77 74.06,24.77 73.5,25.32 73.5,26.14 IC3.4
  Top 0.406: CON1.102 v58.42,2.22
  Bottom 0.178: v29.29,26.64 30.1,25.83 39.98,25.83 v40.56,25.25 | v76.02,17.04 73.38,14.4 58.64,14.4 v58.37,14.13 | v40.56,21.74 40.73,21.91 44.93,21.91 45.16,21.67 45.96,21.67 46.28,21.99 46.28,23.73 46.51,23.97 54.2,23.97 v54.57,23.6 | v81.31,24.07 83.29,24.07 84.53,25.32 86.85,25.32 v86.92,25.25
  Bottom 0.305: CON1.102 v58.42,2.22
A14  (via drill 0.3, 0.6)
  Top 0.178: IC4.3 87.32,26.16 87.32,25.65 87.5,25.48 87.5,24.56 86.2,23.26 85.01,23.26 84.61,22.86 84.61,20.56 83.9,19.84 v83.9,19.63 | IC1.3 27.62,26.17 27.62,21.27 27.86,21.03 27.86,20.72 28.89,19.68 30.16,19.68 30.91,18.94 v30.91,17.76 | v59.69,2.22 59.69,4.52 59.53,4.68 59.53,5.32 60.25,6.03 60.25,9.92 59.13,11.03 59.13,11.75 59.29,11.91 59.29,14.47 59.16,14.61 v59.16,15.21 58.74,15.62 58.74,20.48 52.27,26.94 52.27,26.95 40.97,26.95 40.97,26.26 IC2.3 40.97,26.16 40.97,25.65 41.15,25.48 41.15,19.87 v39.12,17.84 | v75.84,19.95 75.84,21.55 75.17,22.23 75.17,24.92 74.93,25.16 74.22,25.16 73.98,25.4 73.98,26.17 IC3.3
  Top 0.406: CON1.103 v59.69,2.22
  Bottom 0.178: v83.9,19.63 83.34,19.63 83.11,19.4 | v59.16,15.21 59.6,14.76 73.16,14.76 75.41,16.99 75.41,18.02 75.64,18.26 76.52,18.26 76.6,18.18 77.47,18.18 78.42,19.13 81.36,19.13 82.23,18.26 82.79,18.26 83.11,18.57 83.11,19.4 | v30.91,17.76 31.81,17.76 32.86,18.81 34.21,18.81 34.45,19.05 35.08,19.05 35.88,18.26 38.71,18.26 v39.12,17.84 | v75.84,19.95 82.55,19.95 83.11,19.4
  Bottom 0.305: CON1.103 v59.69,2.22
A15  (via drill 0.3, 0.6)
  Top 0.178: v75.64,26.77 75.64,26.9 74.7,26.9 74.52,26.72 74.52,26.24 IC3.2 | v87.35,27.13 87.78,26.7 87.78,26.19 IC4.2 | 41.5,25.45 41.5,26.11 41.45,26.16 IC2.2 | 41.5,25.45 41.5,19.84 41.5,19.63 41.5,19.37 | IC1.2 28.12,26.16 28.12,22.6 29.2,21.52 v29.2,20.29 | v43.21,5.28 42.95,5.54 42.95,11.66 42.55,12.06 42.31,12.06 39.29,15.08 39.29,17.14 39.77,17.62 39.77,17.86 41.27,19.37 41.5,19.37 | 41.5,25.45 v42.52,25.45 | v60.96,2.22 60.96,4.22 v60.16,5.02 | v41.73,19.41 41.69,19.37 41.51,19.37 41.5,19.37
  Top 0.406: CON1.104 v60.96,2.22
  Bottom 0.178: v87.35,27.13 76,27.13 v75.64,26.77 75.56,26.8 75.01,27.36 44.43,27.36 v42.52,25.45 | v43.21,5.28 59.9,5.28 v60.16,5.02 | v29.2,20.29 29.56,20.29 29.61,20.24 31.12,20.24 31.27,20.08 33.5,20.08 33.66,20.24 37.23,20.24 37.54,19.92 38.34,19.92 38.66,19.61 39.61,19.61 39.85,19.37 41.69,19.37 v41.73,19.41
  Bottom 0.305: CON1.104 v60.96,2.22
A16  (via drill 0.3, 0.6)
  Top 0.178: IC2.1 41.96,26.19 41.96,26.36 v42.6,26.36 42.62,26.29 46.2,22.71 46.2,21.91 46.91,21.19 46.91,20.95 54.68,13.18 v54.81,13.18 | 76.43,22.07 76,22.07 75.64,22.43 75.64,25.5 74.98,26.16 IC3.1 | v88.09,25.25 88.29,25.45 88.29,26.16 IC4.1 | v76.81,17.51 76.43,17.89 76.43,22.07 | v60.33,12.6 60.86,12.06 60.86,11.25 v60.88,11.18 60.88,5.05 62.15,3.79 62.15,3.02 62.23,2.94 v62.23,2.22 | 76.43,22.07 77.81,22.07 v78.73,22.99 | v29.26,25.86 28.61,25.86 IC1.1
  Top 0.406: CON1.105 v62.23,2.22
  Bottom 0.178: v29.26,25.86 28.7,26.42 28.7,27.23 41.73,27.23 v42.6,26.36 | v88.09,25.25 87.5,25.83 84.3,25.83 83.13,24.66 80.4,24.66 v78.73,22.99 | v76.81,17.51 76.81,13.47 74.37,11.03 65.48,11.03 65.25,11.27 64.69,11.27 64.45,11.03 61.44,11.03 61.29,11.18 v60.88,11.18 | v54.81,13.18 54.81,11.94 55.01,11.75 58.42,11.75 59.13,12.46 60.19,12.46 v60.33,12.6
  Bottom 0.305: CON1.105 v62.23,2.22
A17  (via drill 0.3, 0.6)
  Top 0.178: v42.04,5.74 41.96,5.82 41.96,6.68 IC2.48 41.99,6.76 42.37,7.14 v42.37,9.68 | IC1.48 28.63,6.22 29.18,5.66 v30.09,5.66 | 76.86,8.59 74.98,6.71 IC3.48 | v87.86,7.62 88.29,7.19 88.29,6.71 IC4.48 | v64.97,10.62 62.99,8.64 62.99,4.29 63.5,3.79 v63.5,2.22 | 76.86,8.59 v74.83,10.62 | v86.05,8.04 83.95,8.04 83.34,8.65 82.71,8.65 81.91,7.86 78.98,7.86 78.25,8.59 76.86,8.59
  Top 0.406: CON1.106 v63.5,2.22
  Bottom 0.178: v74.83,10.62 v64.97,10.62 64.9,10.59 43.28,10.59 v42.37,9.68 | v30.09,5.66 30.22,5.79 31.75,5.79 31.99,5.56 41.85,5.56 v42.04,5.74 | v87.86,7.62 86.47,7.62 v86.05,8.04
  Bottom 0.305: CON1.106 v63.5,2.22
A18  (via drill 0.3, 0.6)
  Top 0.178: v22.73,22.53 22.73,23.11 20.68,25.17 20.68,26.11 20.63,26.16 IC1.17 | v31.32,19.46 33.93,22.07 33.93,26.16 IC2.17 | v68.76,19.59 68.76,23.6 67.03,25.32 67.03,26.11 66.98,26.16 IC3.17 | IC4.17 80.29,26.16 80.29,22.07 79.89,21.67 78.03,21.67 77.95,21.59 77.23,21.59 77.01,21.37 v77.01,19.35 | v61.47,5.28 61.28,5.47 61.28,10.72 61.52,10.95 61.52,11.59 61.28,11.83 61.28,12.3 60.96,12.62 60.96,12.78 60.25,13.49 60.25,16.59 60.55,16.9 v60.55,17.25 61.47,18.16 v61.47,18.49 | v64.77,2.22 64.77,3.1 64.13,3.73 v64.13,4.52
  Top 0.406: CON1.107 v64.77,2.22
  Bottom 0.178: v61.47,5.28 62.81,5.28 63.58,4.52 v64.13,4.52 | v22.73,22.53 24.06,22.53 25.56,21.03 26.04,21.03 26.91,20.16 | 26.91,20.16 28.42,20.16 28.89,19.68 31.09,19.68 v31.32,19.46 | 26.91,20.16 27.15,19.92 27.15,18.18 27.54,17.78 27.94,17.78 28.5,18.34 29.92,18.34 30.24,18.02 30.24,17.54 30.72,17.07 31.19,17.07 31.43,17.3 31.99,17.3 33.1,18.41 35.08,18.41 35.72,17.78 38.34,17.78 38.5,17.62 38.5,17.46 38.81,17.14 39.53,17.14 39.85,16.83 39.85,16.51 40.24,16.11 56.36,16.11 57.71,17.46 60.34,17.46 v60.55,17.25 | v61.47,18.49 61.47,19.24 61.91,19.68 63.74,19.68 64.13,20.08 66.6,20.08 66.83,19.84 68.5,19.84 v68.76,19.59 69.28,19.59 69.53,19.84 70.33,19.84 70.88,20.4 71.2,20.4 71.44,20.16 72.31,20.16 72.47,20 73.42,20 73.5,20.08 74.22,20.08 74.53,20.4 74.85,20.4 75.09,20.16 75.09,19.68 75.56,19.21 76.04,19.21 76.36,19.53 76.84,19.53 v77.01,19.35
  Bottom 0.305: CON1.107 v64.77,2.22
A19  (via drill 0.3, 0.6)
  Top 0.178: 34.7,24.71 34.7,25.45 34.47,25.68 34.47,26.16 IC2.16 | IC1.16 21.13,26.16 21.18,26.11 21.18,25.43 23.32,23.29 23.32,21.11 24.26,20.16 25.4,20.16 26.99,18.57 26.99,18.34 27.54,17.78 27.94,17.78 28.5,18.34 28.5,18.97 28.81,19.29 29.85,19.29 30.24,18.89 30.24,17.54 30.72,17.07 31.19,17.07 31.59,17.46 31.59,18.81 31.99,19.21 31.99,19.37 34.37,21.75 34.37,24.39 34.7,24.71 | v62.81,26.77 62.81,26.9 67.23,26.9 67.39,26.75 67.39,26.26 IC3.16 | v80.9,25.25 80.82,25.32 80.82,26.16 IC4.16 | 62.79,26.7 v62.81,26.77 | v35.81,24.71 34.7,24.71 | v62.81,26.77 62.79,26.74 62.79,24.92 63.18,24.53 63.34,24.53 63.82,24.05 64.21,24.05 64.61,23.65 65.09,23.65 65.48,23.26 65.96,23.26 66.36,22.86 66.68,22.86 66.91,22.62 67.55,22.62 67.71,22.46 67.71,22.07 63.18,17.54 61.67,17.54 61.28,17.14 61.28,16.91 60.64,16.27 60.64,13.65 61.36,12.94 61.36,12.78 61.67,12.46 61.67,11.99 61.91,11.75 61.91,10.72 61.67,10.48 61.67,6.03 62.05,5.66 v62.05,4.7 | v66.04,2.22 66.04,3.33 65.43,3.94 v65.35,3.94
  Top 0.406: CON1.108 v66.04,2.22
  Bottom 0.178: v80.9,25.25 80.31,25.83 63.75,25.83 v62.81,26.77 62.68,26.91 44.69,26.91 43.26,25.48 43.26,25.12 42.8,24.66 35.87,24.66 v35.81,24.71 | v62.05,4.7 62.81,3.94 v65.34,3.94 v65.35,3.94
  Bottom 0.305: CON1.108 v66.04,2.22
A20  (via drill 0.3, 0.6)
  Top 0.178: IC1.9 24.59,26.16 24.54,26.11 24.54,21.51 25.02,21.03 25.88,21.03 26.75,20.16 27.16,20.16 v27.84,19.48 | IC2.9 37.92,26.16 37.87,26.11 37.87,19.39 v37.75,19.27 | v82.47,19.02 84.23,20.78 84.23,26.11 84.28,26.16 IC4.9 | v66.14,18.86 65.69,18.86 63.74,16.91 63.74,16.43 63.26,15.95 62.63,15.95 61.91,16.67 61.59,16.67 61.04,16.11 61.04,13.81 61.75,13.1 61.75,12.94 62.07,12.62 62.07,12.14 62.31,11.91 62.31,10.56 62.07,10.32 62.07,6.27 62.64,5.71 62.64,3.47 v62.83,3.28 | IC3.9 70.97,22.7 70.88,22.62 70.88,22.15 71.44,21.59 71.44,21.43 71.83,21.03 72.15,21.03 72.63,20.56 73.18,20.56 74.34,19.4 v74.41,19.4
  Top 0.406: CON1.109 v67.31,2.22
  Bottom 0.178: v27.84,19.48 28.03,19.29 30.56,19.29 31.04,18.81 31.59,18.81 32.39,19.61 33.73,19.61 33.97,19.84 37.02,19.84 37.59,19.27 v37.75,19.27 37.81,19.21 39.37,19.21 40.43,18.15 40.43,17.83 41.2,17.07 41.2,16.75 41.43,16.51 56.12,16.51 57.47,17.86 61.75,17.86 62.07,18.18 62.07,19.05 62.31,19.29 63.98,19.29 64.37,19.68 66.28,19.68 66.52,19.45 66.99,19.45 | 66.99,19.45 68.02,19.45 68.5,18.97 69.37,18.97 69.77,19.37 70.64,19.37 70.96,19.68 72.15,19.68 72.43,19.4 v74.41,19.4 74.66,19.4 75.33,18.73 76.6,18.73 76.68,18.65 77.31,18.65 77.71,19.05 77.71,19.29 77.95,19.53 81.97,19.53 v82.47,19.02 82.29,19.21 | v66.14,18.86 66.41,18.86 66.99,19.45 | v67.31,2.22 67.31,2.86 66.89,3.28 v62.83,3.28
  Bottom 0.305: CON1.109 v67.31,2.22
D0  (via drill 0.6)
  Top 0.178: v22.86,2.22 22.86,3.57 21.51,4.92 20.16,4.92 19.11,5.97 IC1.29
  Top 0.406: CON1.78 v22.86,2.22
  Bottom 0.305: CON1.78 v22.86,2.22
D1  (via drill 0.6)
  Top 0.178: v24.13,2.22 24.13,2.94 21.75,5.32 20.8,5.32 20.11,6 IC1.31
  Top 0.406: CON1.79 v24.13,2.22
  Bottom 0.305: CON1.79 v24.13,2.22
D2  (via drill 0.6)
  Top 0.178: 25.4,2.46 v25.4,2.22 25.4,2.78 25.08,3.1 24.53,3.1 21.91,5.71 21.59,5.71 21.11,6.2 IC1.33
  Top 0.406: CON1.80 v25.4,2.22
  Bottom 0.305: CON1.80 v25.4,2.22
D3  (via drill 0.6)
  Top 0.178: v26.67,2.22 26.67,2.78 25.96,3.49 24.69,3.49 22.11,6.07 IC1.35
  Top 0.406: CON1.81 v26.67,2.22
  Bottom 0.305: CON1.81 v26.67,2.22
D4  (via drill 0.6)
  Top 0.178: v27.94,2.22 27.94,2.7 26.75,3.89 24.84,3.89 23.61,5.12 IC1.38
  Top 0.406: CON1.82 v27.94,2.22
  Bottom 0.305: CON1.82 v27.94,2.22
D5  (via drill 0.6)
  Top 0.178: v29.21,2.22 29.21,2.86 28.58,3.49 27.78,3.49 26.99,4.29 25.08,4.29 24.61,4.76 IC1.40
  Top 0.406: CON1.83 v29.21,2.22
  Bottom 0.305: CON1.83 v29.21,2.22
D6  (via drill 0.6)
  Top 0.178: v30.48,2.22 30.48,2.62 29.13,3.97 27.86,3.97 27.07,4.76 26.11,4.76 25.61,5.27 IC1.42
  Top 0.406: CON1.84 v30.48,2.22
  Bottom 0.305: CON1.84 v30.48,2.22
D7  (via drill 0.6)
  Top 0.178: v31.75,2.22 31.75,3.02 30.4,4.37 28.02,4.37 27.15,5.24 26.83,5.24 26.61,5.46 IC1.44
  Top 0.406: CON1.85 v31.75,2.22
  Bottom 0.305: CON1.85 v31.75,2.22
D8  (via drill 0.6)
  Top 0.178: v33.02,2.22 33.02,5.24 32.45,5.81 IC2.29
  Top 0.406: CON1.86 v33.02,2.22
  Bottom 0.305: CON1.86 v33.02,2.22
D9  (via drill 0.6)
  Top 0.178: v34.29,2.22 34.29,2.82 33.45,3.66 IC2.31
  Top 0.406: CON1.87 v34.29,2.22
  Bottom 0.305: CON1.87 v34.29,2.22
D10  (via drill 0.6)
  Top 0.178: v35.56,2.22 35.56,3.06 34.45,4.17 IC2.33
  Top 0.406: CON1.88 v35.56,2.22
  Bottom 0.305: CON1.88 v35.56,2.22
D11  (via drill 0.6)
  Top 0.178: v36.83,2.22 36.83,3.02 35.45,4.4 IC2.35
  Top 0.406: CON1.89 v36.83,2.22
  Bottom 0.305: CON1.89 v36.83,2.22
D12  (via drill 0.6)
  Top 0.178: v38.1,2.22 38.1,2.82 36.95,3.97 IC2.38
  Top 0.406: CON1.90 v38.1,2.22
  Bottom 0.305: CON1.90 v38.1,2.22
D13  (via drill 0.6)
  Top 0.178: v39.37,2.22 39.37,2.66 37.95,4.08 IC2.40
  Top 0.406: CON1.91 v39.37,2.22
  Bottom 0.305: CON1.91 v39.37,2.22
D14  (via drill 0.6)
  Top 0.178: v40.64,2.22 40.64,2.98 38.95,4.67 IC2.42
  Top 0.406: CON1.92 v40.64,2.22
  Bottom 0.305: CON1.92 v40.64,2.22
D15  (via drill 0.6)
  Top 0.178: v41.91,2.22 41.91,2.9 39.95,4.86 IC2.44
  Top 0.406: CON1.93 v41.91,2.22
  Bottom 0.305: CON1.93 v41.91,2.22
D16  (via drill 0.6)
  Top 0.178: v69.85,2.22 69.85,2.7 68.58,3.97 66.44,3.97 65.48,4.92 65.48,6.66 IC3.29
  Top 0.406: CON1.111 v69.85,2.22
  Bottom 0.305: CON1.111 v69.85,2.22
D17  (via drill 0.6)
  Top 0.178: v71.12,2.22 71.12,2.62 69.29,4.45 66.91,4.45 66.47,4.89 IC3.31
  Top 0.406: CON1.112 v71.12,2.22
  Bottom 0.305: CON1.112 v71.12,2.22
D18  (via drill 0.6)
  Top 0.178: v72.39,2.22 72.39,2.78 71.68,3.49 70.96,3.49 69.53,4.92 67.71,4.92 67.47,5.16 IC3.33
  Top 0.406: CON1.113 v72.39,2.22
  Bottom 0.305: CON1.113 v72.39,2.22
D19  (via drill 0.6)
  Top 0.178: v73.66,2.22 73.66,2.78 72.55,3.89 71.2,3.89 69.69,5.4 68.66,5.4 68.47,5.59 IC3.35
  Top 0.406: CON1.114 v73.66,2.22
  Bottom 0.305: CON1.114 v73.66,2.22
D20  (via drill 0.6)
  Top 0.178: v74.93,2.22 74.93,3.02 74.53,3.41 73.66,3.41 72.71,4.37 71.36,4.37 69.97,5.76 IC3.38
  Top 0.406: CON1.115 v74.93,2.22
  Bottom 0.305: CON1.115 v74.93,2.22
D21  (via drill 0.6)
  Top 0.178: v76.2,2.22 76.2,3.02 75.33,3.89 73.9,3.89 73.03,4.76 71.99,4.76 70.96,5.79 IC3.40
  Top 0.406: CON1.116 v76.2,2.22
  Bottom 0.305: CON1.116 v76.2,2.22
D22  (via drill 0.6)
  Top 0.178: IC3.42 71.97,5.9 72.71,5.16 73.26,5.16 74.06,4.37 75.56,4.37 76.52,3.41 77.07,3.41 77.47,3.02 v77.47,2.22
  Top 0.406: CON1.117 v77.47,2.22
  Bottom 0.305: CON1.117 v77.47,2.22
D23  (via drill 0.6)
  Top 0.178: v78.74,2.22 78.74,3.02 77.87,3.89 76.76,3.89 75.8,4.84 74.37,4.84 73.58,5.64 73.18,5.64 72.97,5.85 IC3.44
  Top 0.406: CON1.118 v78.74,2.22
  Bottom 0.305: CON1.118 v78.74,2.22
D24  (via drill 0.6)
  Top 0.178: v80.01,2.22 80.01,2.78 78.8,3.99 IC4.29
  Top 0.406: CON1.119 v80.01,2.22
  Bottom 0.305: CON1.119 v80.01,2.22
D25  (via drill 0.6)
  Top 0.178: v81.28,2.22 81.28,2.94 79.8,4.42 IC4.31
  Top 0.406: CON1.120 v81.28,2.22
  Bottom 0.305: CON1.120 v81.28,2.22
D26  (via drill 0.6)
  Top 0.178: v82.55,2.22 82.55,2.98 80.8,4.73 IC4.33
  Top 0.406: CON1.121 v82.55,2.22
  Bottom 0.305: CON1.121 v82.55,2.22
D27  (via drill 0.6)
  Top 0.178: v83.82,2.22 83.82,2.94 81.8,4.96 IC4.35
  Top 0.406: CON1.122 v83.82,2.22
  Bottom 0.305: CON1.122 v83.82,2.22
D28  (via drill 0.6)
  Top 0.178: v85.09,2.22 85.09,2.86 83.3,4.65 IC4.38
  Top 0.406: CON1.123 v85.09,2.22
  Bottom 0.305: CON1.123 v85.09,2.22
D29  (via drill 0.6)
  Top 0.178: v86.36,2.22 86.36,2.94 84.3,5 IC4.40
  Top 0.406: CON1.124 v86.36,2.22
  Bottom 0.305: CON1.124 v86.36,2.22
D30  (via drill 0.6)
  Top 0.178: v87.63,2.22 87.63,2.9 85.3,5.23 IC4.42
  Top 0.406: CON1.125 v87.63,2.22
  Bottom 0.305: CON1.125 v87.63,2.22
D31  (via drill 0.6)
  Top 0.178: v88.9,2.22 88.9,2.82 86.3,5.42 IC4.44
  Top 0.406: CON1.126 v88.9,2.22
  Bottom 0.305: CON1.126 v88.9,2.22
GND  (via drill 0.3, 0.6, 0.61)
  Top 0.305: IC1.46 IC1.47 28.12,6.55 28.12,6.1 29.19,5.03 30.89,5.03 30.89,5.54 31.45,6.1 31.45,6.55 IC2.27 31.45,6.71 31.45,7.26 32.26,8.08 33.1,8.08 v33.1,8.1 | IC2.47 IC2.46 40.95,6.83 v40.95,7.62 | IC3.46 IC3.47 74.47,6.83 v74.47,7.64 | 87.51,6.12 v87.54,6.15 87.54,6.44 IC4.46 IC4.47 | 18.11,5.41 IC1.27 18.11,6.83 18.11,7.47 18.72,8.08 v18.73,8.1 | v65.64,8.26 65.46,8.26 64.47,7.26 64.47,6.71 IC3.27 | 77.8,6.71 IC4.27 v77.8,8 | v27.92,8.79 19.51,8.79 | 41.2,6.67 41.2,4.5 43.18,2.52 v43.18,2.22 | v77.8,8
  Top 0.406: CON1.128 v91.44,2.22 91.44,3.41 90.57,4.29 88.58,4.29 87.54,5.33 v87.54,6.15 | CON1.74 v17.78,2.22 17.78,5.08 18.11,5.41 | CON1.94 v43.18,2.22
  Bottom 0.305: C3.2 v65.64,8.26 | C2.2 v33.1,8.1 | C1.2 v18.73,8.1 | 77.79,8.18 79.4,8.18 C4.2 | 77.79,8.18 75.01,8.18 v74.47,7.64 74.4,7.52 67.41,7.52 66.22,8.71 C3.2 | v27.92,8.79 28.52,8.18 32.97,8.18 C2.2 | C2.2 33.68,8.61 34.87,9.8 38.76,9.8 v40.95,7.62 41.07,7.7 42.42,9.04 64.77,9.04 65.51,8.31 C3.2 | v77.8,8 77.79,8.02 77.79,8.18
  Bottom 0.406: C4.2 82.5,6.15 v87.54,6.15
  other vias: 47.23,8.73 20.32,21.59 47.39,13.89 10.87,6.75 7.94,26.19 57.47,8.81 70.8,16.11 67.79,13.26 65.25,16.51 79.38,13.34 93.11,25.8 32.7,12.38 48.97,4.21 18.63,4.66 27.91,5.61 37.23,13.65 53.98,18.73 59.93,19.92
  pour Top (isolate 0.406): 0.24,27.54 97.63,27.54 97.63,0.24 50.8,0.24 arc180 47.07,0.24 2.3,0.24 2.3,4.76 arc90 0.4,6.67 0.24,6.67
  pour Bottom (isolate 0.406): 0.24,27.54 97.63,27.54 97.63,0.24 50.8,0.24 arc180 47.07,0.24 2.3,0.24 2.3,4.76 arc90 0.4,6.67 0.24,6.67
UNUSED1  (via drill 0.6)
  Top 0.406: v7.62,2.22 CON1.66
  Bottom 0.305: CON1.66 v7.62,2.22
UNUSED2  (via drill 0.6)
  Top 0.406: v8.89,2.22 CON1.67
  Bottom 0.305: CON1.67 v8.89,2.22
UNUSED3  (via drill 0.6)
  Top 0.406: v90.17,2.22 CON1.127
  Bottom 0.305: CON1.127 v90.17,2.22
VCC  (via drill 0.3, 0.6)
  Top 0.305: IC4.12 82.8,27.13 | IC1.12 23.11,27.45 23.1,27.46 | 36.43,27.46 36.45,27.45 IC2.12 36.45,26.04 36.45,24.43 35.05,23.04 35.05,9.39 v36.35,8.1 36.45,8.01 IC2.37 | 69.45,27.46 69.47,27.45 IC3.12 69.47,26.04 69.47,25.6 69.39,25.53 69.39,8.38 v69.29,8.26 69.32,8.26 69.47,8.1 69.47,6.71 IC3.37 | v82.47,5.11 82.8,5.44 82.8,6.53 IC4.37 82.8,6.71 82.8,7.71 v83.03,7.94 | v22.38,8.1 23.11,7.37 23.11,6.71 IC1.37
  Top 0.406: CON1.65 v6.35,2.22 6.35,3.33 6.91,3.89 12.62,3.89 13.1,4.37 13.57,4.37 13.97,4.76 13.97,7.3 16.51,9.84 16.51,23.89 16.11,24.29 16.11,26.59 16.99,27.46 23.1,27.46 36.43,27.46 69.45,27.46 82.47,27.46 82.8,27.13 | CON1.110 v68.58,2.22
  Bottom 0.305: v69.29,8.26 C3.1 69.44,8.31 71.12,9.98 81.38,9.98 82.57,8.79 C4.1 v83.03,7.94 | v36.35,8.1 C2.1 36.17,8.53 34.98,7.34 29.67,7.34 29.31,7.7 22.86,7.7 22.53,8.03 C1.1 v22.38,8.1 | v82.47,5.11 70.28,5.11 68.45,3.28 68.45,2.46 68.5,2.41 CON1.110 v68.58,2.22 | CON1.65 v6.35,2.22

### Text on the board
bPlace: 8 MB Mac ROM SIMM / downtowndougbrown.com